# EAGLE design 40 pin adapter (EAGLE 7.4.0)
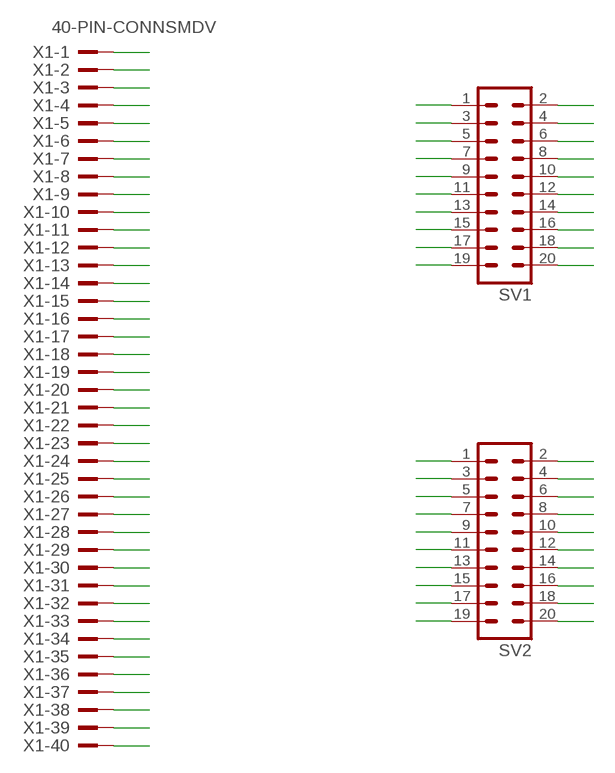
[diagram p0: schematic, sheet 1]

## Parts
SV1  MA10-2  [MA10-2]
SV2  MA10-2  [MA10-2]
X1  40-PIN-CONNSMDV  [SMD]

## Nets
1: SV1.1 X1.1
2: SV1.2 X1.2
3: SV1.3 X1.3
4: SV1.4 X1.4
5: SV1.5 X1.5
6: SV1.6 X1.6
7: SV1.7 X1.7
8: SV1.8 X1.8
9: SV1.9 X1.9
10: SV1.10 X1.10
11: SV1.11 X1.11
12: SV1.12 X1.12
13: SV1.13 X1.13
14: SV1.14 X1.14
15: SV1.15 X1.15
16: SV1.16 X1.16
17: SV1.17 X1.17
18: SV1.18 X1.18
19: SV1.19 X1.19
20: SV1.20 X1.20
21: SV2.1 X1.21
22: SV2.2 X1.22
23: SV2.3 X1.23
24: SV2.4 X1.24
25: SV2.5 X1.25
26: SV2.6 X1.26
27: SV2.7 X1.27
28: SV2.8 X1.28
29: SV2.9 X1.29
30: SV2.10 X1.30
31: SV2.11 X1.31
32: SV2.12 X1.32
33: SV2.13 X1.33
34: SV2.14 X1.34
35: SV2.15 X1.35
36: SV2.16 X1.36
37: SV2.17 X1.37
38: SV2.18 X1.38
39: SV2.19 X1.39
40: SV2.20 X1.40

## Library data of the parts
SV1 SV2 = con-lstb:MA10-2: PIN HEADER; OC_FARNELL: unknown; OC_NEWARK: unknown
X1 = surdu:40-PIN-CONN: 3M (TM) Pak 100 4-Wall Header Source: 3M

## Board
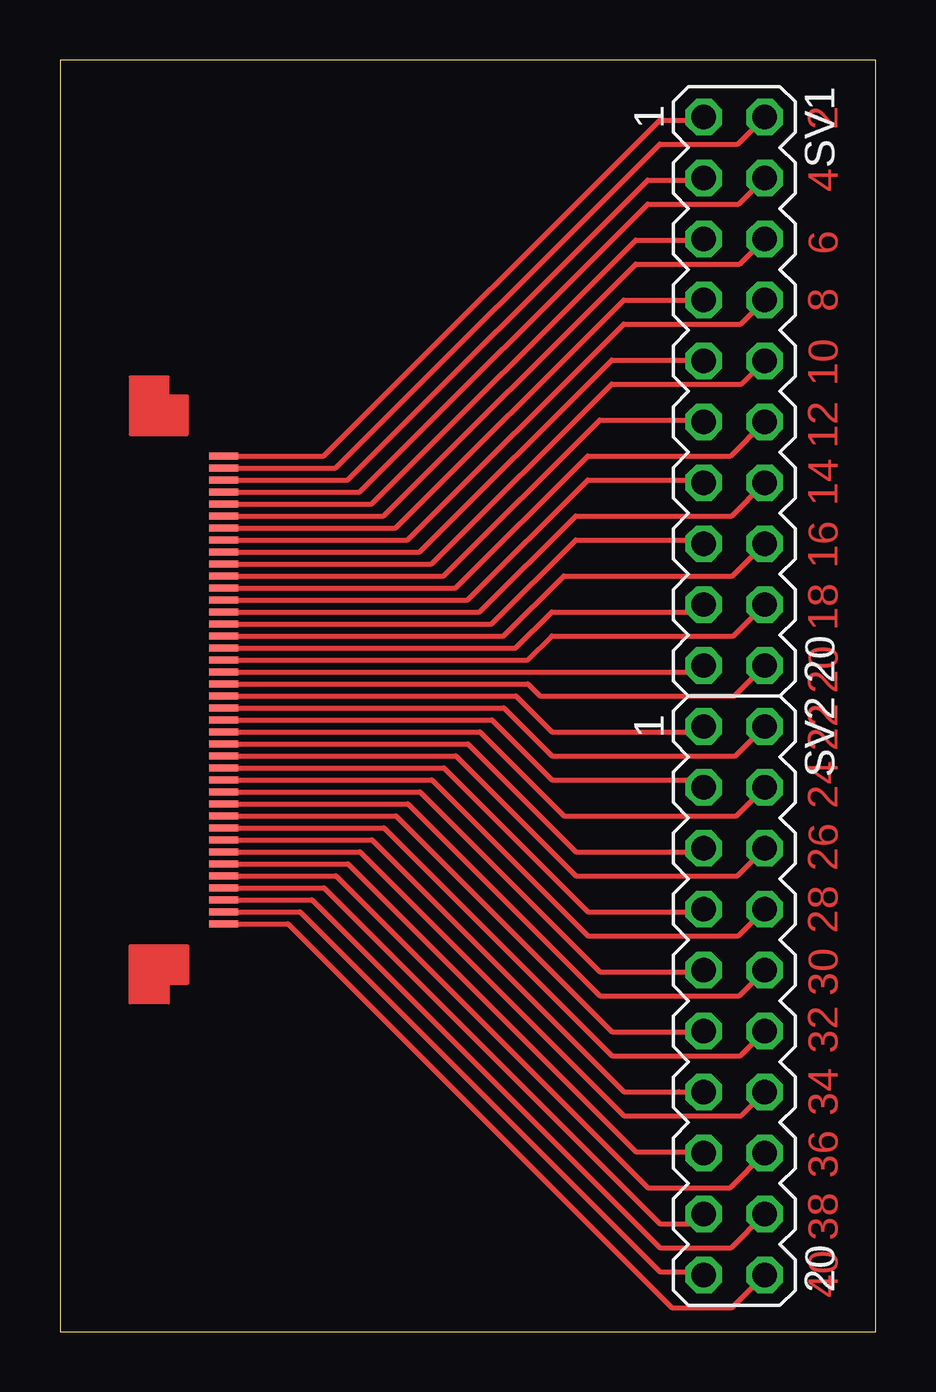
[diagram p1: board, top side]

Size 34 x 53 mm. Coordinates in mm from the lower left corner, seen from the top.
Outline: 0,0 34,0 34,53 0,53 0,0
Copper layers (1*16): Top 0.035mm / dielectric 1.5mm / Bottom 0.035mm
Design rules "default": minimum track width 10mil, minimum drill 24mil, track to track 8mil, track to pad 8mil, pad to pad 8mil, via to via 8mil, smd to smd 8mil, copper to edge 40mil, drill to drill 8mil, minimum pad ring 10mil, minimum via ring 8mil, stop-mask expansion 4mil, vias tented up to drill 0mil, thermal gap 10mil

### Footprints (pad centres in the part's own frame; a part is rotated, then mirrored left to right if it is on the bottom)
MA10-2 = drill 1.016 octagon: 1 -11.43,-1.27; 2 -11.43,1.27; 3 -8.89,-1.27; 4 -8.89,1.27; 5 -6.35,-1.27; 6 -6.35,1.27; 7 -3.81,-1.27; 8 -3.81,1.27; 9 -1.27,-1.27; 10 -1.27,1.27; 11 1.27,-1.27; 12 1.27,1.27; 13 3.81,-1.27; 14 3.81,1.27; 15 6.35,-1.27; 16 6.35,1.27; 17 8.89,-1.27; 18 8.89,1.27; 19 11.43,-1.27; 20 11.43,1.27
SMD = smd 0.3 x 1.2: 1 -10,0; 2 -9.5,0; 3 -9,0; 4 -8.5,0; 5 -8,0; 6 -7.5,0; 7 -7,0; 8 -6.5,0; 9 -6,0; 10 -5.5,0; 11 -5,0; 12 -4.5,0; 13 -4,0; 14 -3.5,0; 15 -3,0; 16 -2.5,0; 17 -2,0; 18 -1.5,0; 19 -1,0; 20 -0.5,0; 21 0,0; 22 0.5,0; 23 1,0; 24 1.5,0; 25 2,0; 26 2.5,0; 27 3,0; 28 3.5,0; 29 4,0; 30 4.5,0; 31 5,0; 32 5.5,0; 33 6,0; 34 6.5,0; 35 7,0; 36 7.5,0; 37 8,0; 38 8.5,0; 39 9,0; 40 9.5,0

### Placement (x,y rotation side)
SV1  28.11,39.19 270 top
SV2  28.11,13.79 270 top
X1  6.82,26.49 270 top

### Tracks (layer width: path | path; a pad name or v marks a point on that pad's centre or on a via)
1
  Top 0.2: X1.1 10.99,36.49 25,50.5 26.72,50.5 SV1.1
2
  Top 0.2: X1.2 11.49,35.99 25,49.5 28.26,49.5 SV1.2
3
  Top 0.2: X1.3 11.99,35.49 24.5,48 26.76,48 SV1.3
4
  Top 0.2: X1.4 12.49,34.99 24.5,47 28.3,47 SV1.4
5
  Top 0.2: X1.5 12.99,34.49 24,45.5 26.8,45.5 SV1.5
6
  Top 0.2: X1.6 13.49,33.99 24,44.5 28.34,44.5 SV1.6
7
  Top 0.2: X1.7 13.99,33.49 23.5,43 SV1.7
8
  Top 0.2: X1.8 14.49,32.99 23.5,42 28.38,42 SV1.8
9
  Top 0.2: X1.9 14.99,32.49 23,40.5 26.8,40.5 SV1.9
10
  Top 0.2: X1.10 15.49,31.99 23,39.5 28.42,39.5 SV1.10
11
  Top 0.2: X1.11 15.99,31.49 22.5,38 26.76,38 SV1.11
12
  Top 0.2: X1.12 16.49,30.99 22,36.5 27.96,36.5 SV1.12
13
  Top 0.2: X1.13 16.99,30.49 22,35.5 26.72,35.5 SV1.13
14
  Top 0.2: X1.14 17.49,29.99 21.5,34 28,34 SV1.14
15
  Top 0.2: X1.15 17.99,29.49 21.5,33 26.68,33 SV1.15
16
  Top 0.2: X1.16 18.49,28.99 21,31.5 28.04,31.5 SV1.16
17
  Top 0.2: X1.17 18.99,28.49 20.5,30 26.54,30 SV1.17
18
  Top 0.2: X1.18 19.49,27.99 20.5,29 28.08,29 SV1.18
19
  Top 0.2: X1.19 26.57,27.49 SV1.19
20
  Top 0.2: X1.20 19.51,26.99 20,26.5 28.12,26.5 SV1.20
21
  Top 0.2: X1.21 19.01,26.49 20.5,25 26.62,25 SV2.1
22
  Top 0.2: X1.22 18.51,25.99 20.5,24 28.16,24 SV2.2
23
  Top 0.2: X1.23 18.01,25.49 20.5,23 26.52,23 SV2.3
24
  Top 0.2: X1.24 17.51,24.99 21,21.5 28.2,21.5 SV2.4
25
  Top 0.2: X1.25 17.01,24.49 21.5,20 26.7,20 SV2.5
26
  Top 0.2: X1.26 16.51,23.99 21.5,19 28.24,19 SV2.6
27
  Top 0.2: X1.27 16.01,23.49 22,17.5 26.74,17.5 SV2.7
28
  Top 0.2: X1.28 15.51,22.99 22,16.5 28.28,16.5 SV2.8
29
  Top 0.2: X1.29 15.01,22.49 22.5,15 26.78,15 SV2.9
30
  Top 0.2: X1.30 14.51,21.99 22.5,14 28.32,14 SV2.10
31
  Top 0.2: X1.31 14.01,21.49 23,12.5 26.32,12.5 SV2.11
32
  Top 0.2: X1.32 13.51,20.99 23,11.5 28.36,11.5 SV2.12
33
  Top 0.2: X1.33 13.01,20.49 23.5,10 25.82,10 SV2.13
34
  Top 0.2: X1.34 6.99,19.99 7,20 12.5,20 23.5,9 28.4,9 SV2.14
35
  Top 0.2: X1.35 12.01,19.49 24,7.5 26.78,7.5 SV2.15
36
  Top 0.2: X1.36 11.51,18.99 24.5,6 27.94,6 SV2.16
37
  Top 0.2: X1.37 11.01,18.49 25,4.5 26.44,4.5 SV2.17
38
  Top 0.2: X1.38 10.51,17.99 25,3.5 27.98,3.5 SV2.18
39
  Top 0.2: X1.39 10.01,17.49 25,2.5 26.7,2.5 SV2.19
40
  Top 0.2: X1.40 9.51,16.99 25.5,1 28.02,1 SV2.20

### Text on the board
Top: 2 | 4 | 6 | 8 | 10 | 12 | 14 | 16 | 18 | 20 | 22 | 24 | 26 | 28 | 30 | 32 | 34 | 36 | 38 | 40